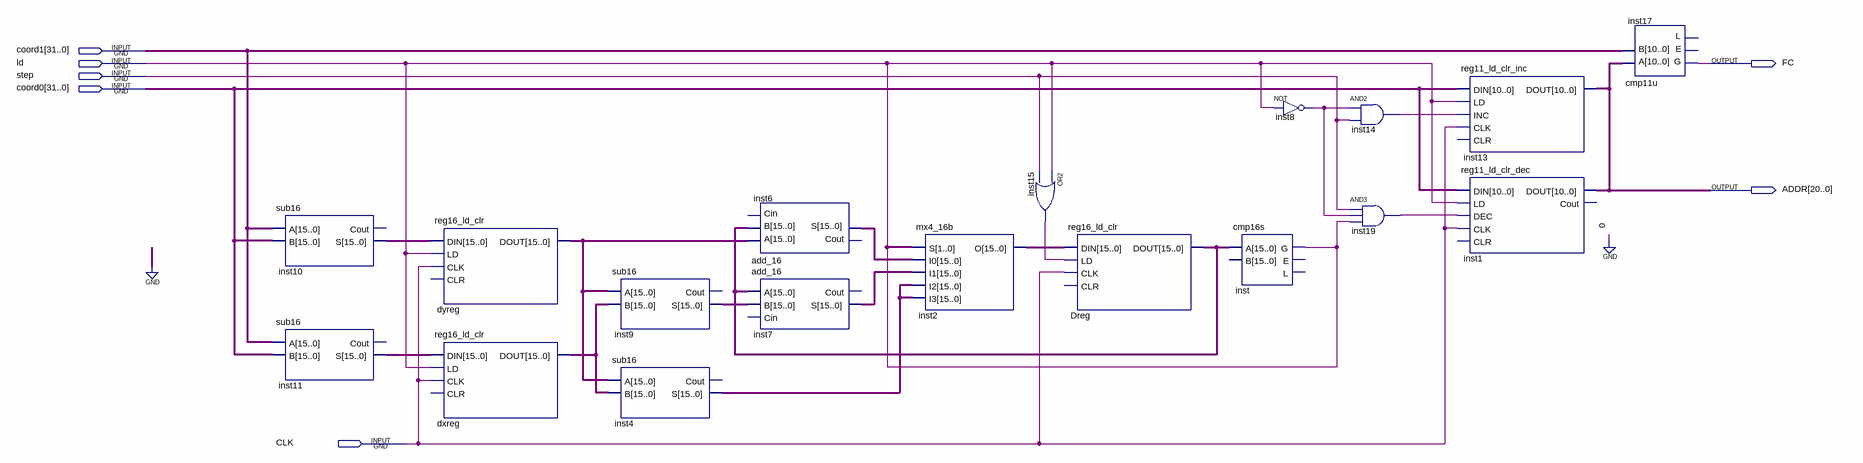
[diagram p0: schematic sheet]
// Quartus schematic gca_dln_oct3.bdf as structural Verilog: 18 symbols, 7 pins
module gca_dln_oct3 (
  input  [31:0] coord1,
  input  ld,
  input  step,
  input  [31:0] coord0,
  input  CLK,
  output FC,
  output [21:0] ADDR
);

  wire inst8_out, inst14_out, inst15_out, inst19_out;
  wire [0:0] s;
  wire [15:0] Dreg_dout, dx, dy, inst2_o, inst4_s, inst6_s, inst7_s, inst9_s, inst10_s, inst11_s;

  sub16 inst10 (.A({{5{1'b0}}, coord1[21:11]}), .B({{5{1'b0}}, coord0[21:11]}), .S(inst10_s));  // open: Cout
  sub16 inst11 (.A({{5{1'b0}}, coord1[10:0]}), .B({{5{1'b0}}, coord0[10:0]}), .S(inst11_s));  // open: Cout
  reg16_ld_clr dyreg (.CLK(CLK), .DIN(inst10_s), .LD(ld), .DOUT(dy));  // open: CLR
  reg16_ld_clr dxreg (.CLK(CLK), .DIN(inst11_s), .LD(ld), .DOUT(dx));  // open: CLR
  sub16 inst9 (.A({dy[14:0], 1'b0}), .B({dx[14:0], 1'b0}), .S(inst9_s));  // open: Cout
  sub16 inst4 (.A({dy[14:0], 1'b0}), .B(dx), .S(inst4_s));  // open: Cout
  add_16 inst6 (.A({dy[14:0], 1'b0}), .B(Dreg_dout), .S(inst6_s));  // open: Cin, Cout
  add_16 inst7 (.A(Dreg_dout), .B(inst9_s), .S(inst7_s));  // open: Cin, Cout
  mx4_16b inst2 (.S({ld, s[0]}), .I0(inst6_s), .I1(inst7_s), .I2(inst4_s), .I3(inst4_s), .O(inst2_o));
  or inst15 (inst15_out, ld, step);
  reg16_ld_clr Dreg (.DIN(inst2_o), .LD(inst15_out), .CLK(CLK), .DOUT(Dreg_dout));  // open: CLR
  cmp16s inst (.A(Dreg_dout), .G(s[0]));  // open: B, E, L
  not inst8 (inst8_out, ld);
  and inst14 (inst14_out, inst8_out, step);
  and inst19 (inst19_out, step, inst8_out, s[0]);
  reg11_ld_clr_inc inst13 (.CLK(CLK), .DIN(coord0[10:0]), .INC(inst14_out), .LD(ld), .DOUT(ADDR[10:0]));  // open: CLR
  reg11_ld_clr_dec inst1 (
    .DIN(coord0[21:11]), .LD(ld), .DEC(inst19_out), .CLK(CLK), .DOUT(ADDR[21:11]));  // open: CLR, Cout
  cmp11u inst17 (.A(ADDR[10:0]), .B(coord1[10:0]), .G(FC));  // open: E, L

  // Other names for the same wires on the sheet: s[1] = ld; uc0[9:0] = coord0[31:22]; uc1[9:0] = coord1[31:22];
  //   x0[10:0] = coord0[10:0]; x1[10:0] = coord1[10:0]; y0[10:0] = coord0[21:11]; y1[10:0] = coord1[21:11]
endmodule
